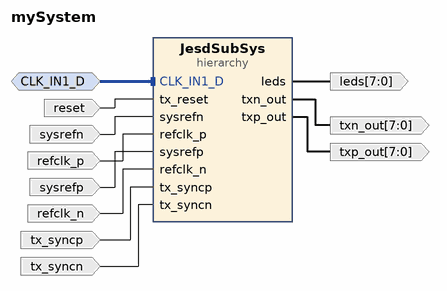
[diagram p0: block diagram of the top level]
# Vivado block design mySystem, xcku040-ffva1156-2-e, Vivado 2019.2
create_bd_design mySystem

create_bd_intf_port -mode Slave -vlnv xilinx.com:interface:diff_clock_rtl:1.0 CLK_IN1_D
set_property -dict {CONFIG.FREQ_HZ 300000000} [get_bd_intf_ports CLK_IN1_D]
create_bd_port -dir I -type rst reset
set_property -dict {CONFIG.POLARITY ACTIVE_HIGH} [get_bd_ports reset]
create_bd_port -dir O -from 7 -to 0 leds
create_bd_port -dir I sysrefn
create_bd_port -dir I refclk_p
create_bd_port -dir I sysrefp
create_bd_port -dir I refclk_n
create_bd_port -dir O -from 7 -to 0 txp_out
create_bd_port -dir O -from 7 -to 0 txn_out
create_bd_port -dir I tx_syncp
create_bd_port -dir I tx_syncn

create_bd_cell -type hier JesdSubSys

# ---- hierarchy /JesdSubSys ----
current_bd_instance /JesdSubSys
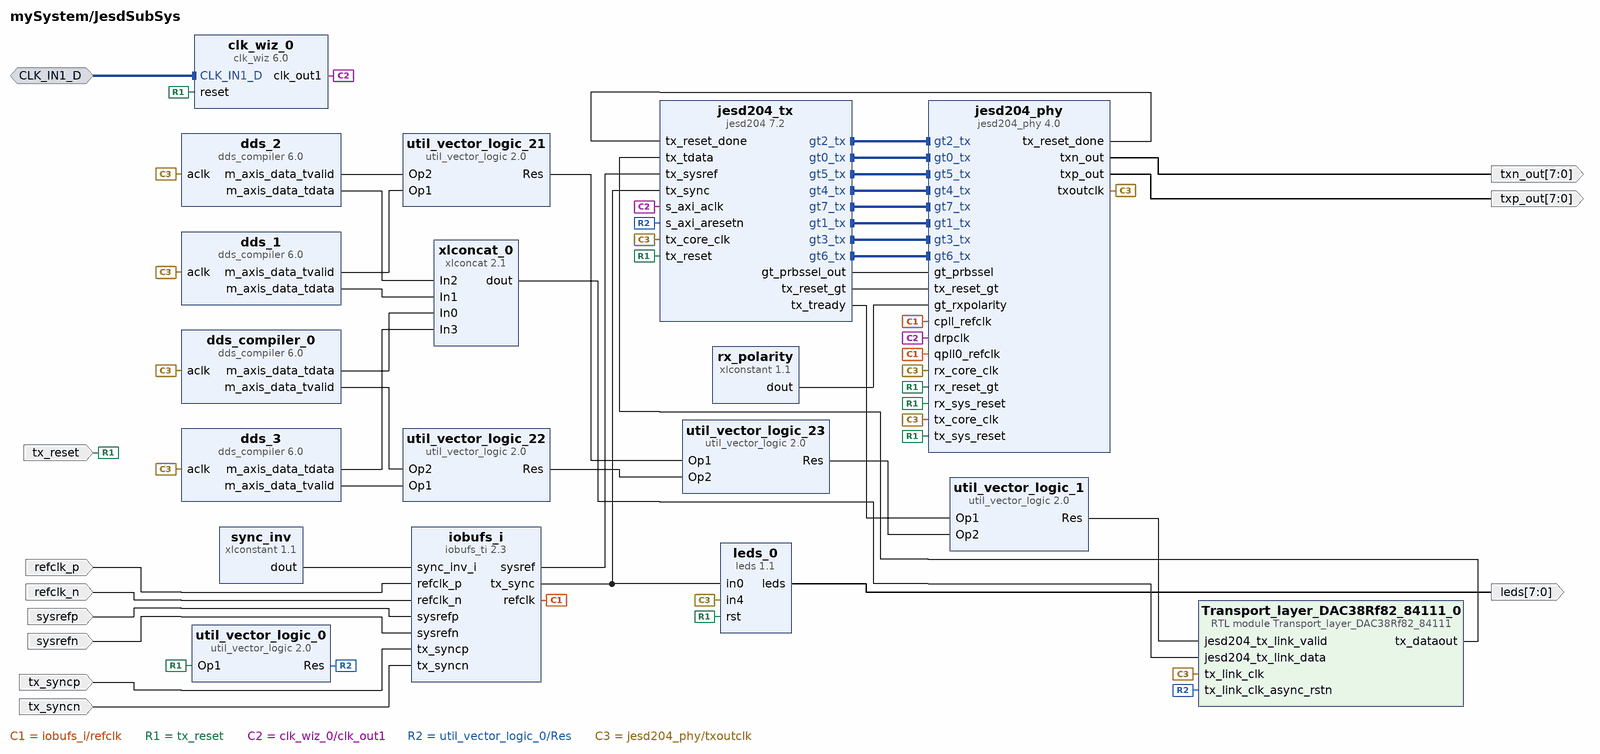
[diagram p1: block diagram inside /JesdSubSys]
create_bd_intf_pin -mode Slave -vlnv xilinx.com:interface:diff_clock_rtl:1.0 CLK_IN1_D
create_bd_pin -dir O -from 7 -to 0 leds
create_bd_pin -dir I refclk_n
create_bd_pin -dir I refclk_p
create_bd_pin -dir I sysrefn
create_bd_pin -dir I sysrefp
create_bd_pin -dir I tx_reset
create_bd_pin -dir O -from 7 -to 0 txp_out
create_bd_pin -dir O -from 7 -to 0 txn_out
create_bd_pin -dir I tx_syncp
create_bd_pin -dir I tx_syncn

create_bd_cell -type ip -vlnv user.org:user:leds:1.1 leds_0
set_property -dict {CONFIG.CNFG 120} [get_bd_cells leds_0]
create_bd_cell -type ip -vlnv user.org:user:iobufs_ti:2.3 iobufs_i
create_bd_cell -type module -reference Transport_layer_DAC38Rf82_84111 Transport_layer_DAC38Rf82_84111_0
create_bd_cell -type ip -vlnv xilinx.com:ip:util_vector_logic:2.0 util_vector_logic_0
set_property -dict {CONFIG.C_OPERATION not CONFIG.C_SIZE 1} [get_bd_cells util_vector_logic_0]
create_bd_cell -type ip -vlnv xilinx.com:ip:util_vector_logic:2.0 util_vector_logic_1
set_property -dict {CONFIG.C_OPERATION or CONFIG.C_SIZE 1} [get_bd_cells util_vector_logic_1]
create_bd_cell -type ip -vlnv xilinx.com:ip:util_vector_logic:2.0 util_vector_logic_21
set_property -dict {CONFIG.C_SIZE 1} [get_bd_cells util_vector_logic_21]
create_bd_cell -type ip -vlnv xilinx.com:ip:util_vector_logic:2.0 util_vector_logic_23
set_property -dict {CONFIG.C_SIZE 1} [get_bd_cells util_vector_logic_23]
create_bd_cell -type ip -vlnv xilinx.com:ip:util_vector_logic:2.0 util_vector_logic_22
set_property -dict {CONFIG.C_SIZE 1} [get_bd_cells util_vector_logic_22]
create_bd_cell -type ip -vlnv xilinx.com:ip:clk_wiz:6.0 clk_wiz_0
set_property -dict [list \
  CONFIG.CLKIN1_JITTER_PS 33.330000000000005 \
  CONFIG.CLKOUT1_DRIVES BUFGCE \
  CONFIG.CLKOUT1_JITTER 108.112 \
  CONFIG.CLKOUT1_PHASE_ERROR 105.563 \
  CONFIG.CLKOUT1_REQUESTED_OUT_FREQ 100 \
  CONFIG.CLKOUT2_DRIVES BUFGCE \
  CONFIG.CLKOUT2_JITTER 99.774 \
  CONFIG.CLKOUT2_PHASE_ERROR 105.563 \
  CONFIG.CLKOUT2_REQUESTED_OUT_FREQ 100.000 \
  CONFIG.CLKOUT2_USED false \
  CONFIG.CLKOUT3_DRIVES BUFGCE \
  CONFIG.CLKOUT4_DRIVES BUFGCE \
  CONFIG.CLKOUT5_DRIVES BUFGCE \
  CONFIG.CLKOUT6_DRIVES BUFGCE \
  CONFIG.CLKOUT7_DRIVES BUFGCE \
  CONFIG.CLK_IN1_BOARD_INTERFACE default_sysclk_300 \
  CONFIG.FEEDBACK_SOURCE FDBK_AUTO \
  CONFIG.MMCM_CLKFBOUT_MULT_F 2 \
  CONFIG.MMCM_CLKIN1_PERIOD 3.333 \
  CONFIG.MMCM_CLKIN2_PERIOD 10.0 \
  CONFIG.MMCM_CLKOUT0_DIVIDE_F 6 \
  CONFIG.MMCM_CLKOUT1_DIVIDE 1 \
  CONFIG.MMCM_COMPENSATION AUTO \
  CONFIG.MMCM_DIVCLK_DIVIDE 1 \
  CONFIG.NUM_OUT_CLKS 1 \
  CONFIG.PRIMITIVE PLL \
  CONFIG.PRIM_IN_FREQ 300.000 \
  CONFIG.PRIM_SOURCE Differential_clock_capable_pin \
  CONFIG.SECONDARY_SOURCE Single_ended_clock_capable_pin \
  CONFIG.USE_PHASE_ALIGNMENT false \
  CONFIG.USE_SAFE_CLOCK_STARTUP true \
] [get_bd_cells clk_wiz_0]
create_bd_cell -type ip -vlnv xilinx.com:ip:dds_compiler:6.0 dds_compiler_0
set_property -dict [list \
  CONFIG.DATA_Has_TLAST Not_Required \
  CONFIG.DDS_Clock_Rate 192 \
  CONFIG.Frequency_Resolution 0.4 \
  CONFIG.Has_Phase_Out true \
  CONFIG.Latency 8 \
  CONFIG.M_DATA_Has_TUSER Not_Required \
  CONFIG.Noise_Shaping None \
  CONFIG.Output_Frequency1 0 \
  CONFIG.Output_Selection Sine \
  CONFIG.Output_Width 16 \
  CONFIG.PINC1 1101010101100 \
  CONFIG.Parameter_Entry Hardware_Parameters \
  CONFIG.PartsPresent Phase_Generator_and_SIN_COS_LUT \
  CONFIG.Phase_Width 16 \
  CONFIG.Phase_offset Fixed \
  CONFIG.S_PHASE_Has_TUSER Not_Required \
] [get_bd_cells dds_compiler_0]
create_bd_cell -type ip -vlnv xilinx.com:ip:dds_compiler:6.0 dds_2
set_property -dict [list \
  CONFIG.DATA_Has_TLAST Not_Required \
  CONFIG.DDS_Clock_Rate 192 \
  CONFIG.Frequency_Resolution 0.4 \
  CONFIG.Has_Phase_Out true \
  CONFIG.Latency 8 \
  CONFIG.M_DATA_Has_TUSER Not_Required \
  CONFIG.Noise_Shaping None \
  CONFIG.Output_Frequency1 0 \
  CONFIG.Output_Selection Sine \
  CONFIG.Output_Width 16 \
  CONFIG.PINC1 1101010101100 \
  CONFIG.POFF1 110101010110 \
  CONFIG.Parameter_Entry Hardware_Parameters \
  CONFIG.PartsPresent Phase_Generator_and_SIN_COS_LUT \
  CONFIG.Phase_Width 16 \
  CONFIG.Phase_offset Fixed \
  CONFIG.S_PHASE_Has_TUSER Not_Required \
] [get_bd_cells dds_2]
create_bd_cell -type ip -vlnv xilinx.com:ip:dds_compiler:6.0 dds_1
set_property -dict [list \
  CONFIG.DATA_Has_TLAST Not_Required \
  CONFIG.DDS_Clock_Rate 192 \
  CONFIG.Frequency_Resolution 0.4 \
  CONFIG.Has_Phase_Out true \
  CONFIG.Latency 8 \
  CONFIG.M_DATA_Has_TUSER Not_Required \
  CONFIG.Noise_Shaping None \
  CONFIG.Output_Frequency1 0 \
  CONFIG.Output_Selection Sine \
  CONFIG.Output_Width 16 \
  CONFIG.PINC1 1101010101100 \
  CONFIG.POFF1 11010101011 \
  CONFIG.Parameter_Entry Hardware_Parameters \
  CONFIG.PartsPresent Phase_Generator_and_SIN_COS_LUT \
  CONFIG.Phase_Width 16 \
  CONFIG.Phase_offset Fixed \
  CONFIG.S_PHASE_Has_TUSER Not_Required \
] [get_bd_cells dds_1]
create_bd_cell -type ip -vlnv xilinx.com:ip:dds_compiler:6.0 dds_3
set_property -dict [list \
  CONFIG.DATA_Has_TLAST Not_Required \
  CONFIG.DDS_Clock_Rate 192 \
  CONFIG.Frequency_Resolution 0.4 \
  CONFIG.Has_Phase_Out true \
  CONFIG.Latency 8 \
  CONFIG.M_DATA_Has_TUSER Not_Required \
  CONFIG.Noise_Shaping None \
  CONFIG.Output_Frequency1 0 \
  CONFIG.Output_Selection Sine \
  CONFIG.Output_Width 16 \
  CONFIG.PINC1 1101010101100 \
  CONFIG.POFF1 1010000000001 \
  CONFIG.Parameter_Entry Hardware_Parameters \
  CONFIG.PartsPresent Phase_Generator_and_SIN_COS_LUT \
  CONFIG.Phase_Width 16 \
  CONFIG.Phase_offset Fixed \
  CONFIG.S_PHASE_Has_TUSER Not_Required \
] [get_bd_cells dds_3]
create_bd_cell -type ip -vlnv xilinx.com:ip:jesd204_phy:4.0 jesd204_phy
set_property -dict [list \
  CONFIG.Axi_Lite false \
  CONFIG.C_LANES 8 \
  CONFIG.C_PLL_SELECTION 1 \
  CONFIG.DRPCLK_FREQ 100 \
  CONFIG.GT_Line_Rate 7.68 \
  CONFIG.GT_REFCLK_FREQ 192 \
  CONFIG.RX_GT_Line_Rate 7.68 \
  CONFIG.RX_GT_REFCLK_FREQ 192 \
  CONFIG.RX_PLL_SELECTION 0 \
  CONFIG.TransceiverControl true \
] [get_bd_cells jesd204_phy]
create_bd_cell -type ip -vlnv xilinx.com:ip:jesd204:7.2 jesd204_tx
set_property -dict [list \
  CONFIG.AXICLK_FREQ 100.0 \
  CONFIG.C_DEFAULT_F 1 \
  CONFIG.C_DEFAULT_K 20 \
  CONFIG.C_DEFAULT_SCR 0 \
  CONFIG.C_LANES 8 \
  CONFIG.C_NODE_IS_TRANSMIT 1 \
] [get_bd_cells jesd204_tx]
create_bd_cell -type ip -vlnv xilinx.com:ip:xlconcat:2.1 xlconcat_0
set_property -dict [list \
  CONFIG.IN0_WIDTH 16 \
  CONFIG.IN1_WIDTH 16 \
  CONFIG.IN2_WIDTH 16 \
  CONFIG.IN3_WIDTH 16 \
  CONFIG.NUM_PORTS 4 \
  CONFIG.dout_width 64 \
] [get_bd_cells xlconcat_0]
create_bd_cell -type ip -vlnv xilinx.com:ip:xlconstant:1.1 rx_polarity
set_property -dict {CONFIG.CONST_VAL 0 CONFIG.CONST_WIDTH 8} [get_bd_cells rx_polarity]
create_bd_cell -type ip -vlnv xilinx.com:ip:xlconstant:1.1 sync_inv
set_property -dict {CONFIG.CONST_VAL 0 CONFIG.CONST_WIDTH 1} [get_bd_cells sync_inv]

# ---- connections ----

current_bd_instance /JesdSubSys
connect_bd_intf_net [get_bd_intf_pins jesd204_tx/gt2_tx] [get_bd_intf_pins jesd204_phy/gt2_tx]
connect_bd_intf_net [get_bd_intf_pins jesd204_tx/gt0_tx] [get_bd_intf_pins jesd204_phy/gt0_tx]
connect_bd_intf_net [get_bd_intf_pins jesd204_tx/gt5_tx] [get_bd_intf_pins jesd204_phy/gt5_tx]
connect_bd_intf_net [get_bd_intf_pins jesd204_tx/gt4_tx] [get_bd_intf_pins jesd204_phy/gt4_tx]
connect_bd_intf_net [get_bd_intf_pins jesd204_tx/gt7_tx] [get_bd_intf_pins jesd204_phy/gt7_tx]
connect_bd_intf_net [get_bd_intf_pins CLK_IN1_D] [get_bd_intf_pins clk_wiz_0/CLK_IN1_D]
connect_bd_intf_net [get_bd_intf_pins jesd204_tx/gt1_tx] [get_bd_intf_pins jesd204_phy/gt1_tx]
connect_bd_intf_net [get_bd_intf_pins jesd204_tx/gt3_tx] [get_bd_intf_pins jesd204_phy/gt3_tx]
connect_bd_intf_net [get_bd_intf_pins jesd204_tx/gt6_tx] [get_bd_intf_pins jesd204_phy/gt6_tx]
connect_bd_net -net jesd_data_if_0_refclk [get_bd_pins iobufs_i/refclk] [get_bd_pins jesd204_phy/cpll_refclk] [get_bd_pins jesd204_phy/qpll0_refclk]
connect_bd_net [get_bd_pins leds_0/leds] [get_bd_pins leds]
connect_bd_net [get_bd_pins refclk_p] [get_bd_pins iobufs_i/refclk_p]
connect_bd_net [get_bd_pins refclk_n] [get_bd_pins iobufs_i/refclk_n]
connect_bd_net [get_bd_pins sysrefp] [get_bd_pins iobufs_i/sysrefp]
connect_bd_net [get_bd_pins sysrefn] [get_bd_pins iobufs_i/sysrefn]
connect_bd_net -net tx_reset_1 [get_bd_pins tx_reset] \
  [get_bd_pins leds_0/rst] [get_bd_pins util_vector_logic_0/Op1] [get_bd_pins clk_wiz_0/reset] \
  [get_bd_pins jesd204_phy/rx_reset_gt] [get_bd_pins jesd204_phy/tx_sys_reset] [get_bd_pins jesd204_phy/rx_sys_reset] \
  [get_bd_pins jesd204_tx/tx_reset]
connect_bd_net -net xlconstant_0_dout [get_bd_pins rx_polarity/dout] [get_bd_pins jesd204_phy/gt_rxpolarity]
connect_bd_net [get_bd_pins clk_wiz_0/clk_out1] [get_bd_pins jesd204_phy/drpclk] [get_bd_pins jesd204_tx/s_axi_aclk]
connect_bd_net [get_bd_pins util_vector_logic_0/Res] \
  [get_bd_pins Transport_layer_DAC38Rf82_84111_0/tx_link_clk_async_rstn] [get_bd_pins jesd204_tx/s_axi_aresetn]
connect_bd_net -net xlconstant_1_dout [get_bd_pins sync_inv/dout] [get_bd_pins iobufs_i/sync_inv_i]
connect_bd_net -net jesd204_phy_rxoutclk1 [get_bd_pins jesd204_phy/txoutclk] \
  [get_bd_pins leds_0/in4] [get_bd_pins Transport_layer_DAC38Rf82_84111_0/tx_link_clk] [get_bd_pins dds_compiler_0/aclk] \
  [get_bd_pins dds_2/aclk] [get_bd_pins dds_1/aclk] [get_bd_pins dds_3/aclk] [get_bd_pins jesd204_phy/tx_core_clk] \
  [get_bd_pins jesd204_phy/rx_core_clk] [get_bd_pins jesd204_tx/tx_core_clk]
connect_bd_net [get_bd_pins dds_compiler_0/m_axis_data_tvalid] [get_bd_pins util_vector_logic_22/Op2]
connect_bd_net -net Sample_2 [get_bd_pins dds_2/m_axis_data_tdata] [get_bd_pins xlconcat_0/In2]
connect_bd_net -net Concat_OP [get_bd_pins xlconcat_0/dout] [get_bd_pins Transport_layer_DAC38Rf82_84111_0/jesd204_tx_link_data]
connect_bd_net [get_bd_pins jesd204_tx/gt_prbssel_out] [get_bd_pins jesd204_phy/gt_prbssel]
connect_bd_net [get_bd_pins jesd204_tx/tx_reset_gt] [get_bd_pins jesd204_phy/tx_reset_gt]
connect_bd_net [get_bd_pins jesd204_phy/tx_reset_done] [get_bd_pins jesd204_tx/tx_reset_done]
connect_bd_net [get_bd_pins iobufs_i/sysref] [get_bd_pins jesd204_tx/tx_sysref]
connect_bd_net -net Sample_0 [get_bd_pins dds_compiler_0/m_axis_data_tdata] [get_bd_pins xlconcat_0/In0]
connect_bd_net -net iobufs_i_tx_sync [get_bd_pins iobufs_i/tx_sync] [get_bd_pins leds_0/in0] [get_bd_pins jesd204_tx/tx_sync]
connect_bd_net [get_bd_pins jesd204_phy/txp_out] [get_bd_pins txp_out]
connect_bd_net [get_bd_pins jesd204_phy/txn_out] [get_bd_pins txn_out]
connect_bd_net -net Transport_layer_DAC38Rf82_84111_0_rx_dataout [get_bd_pins Transport_layer_DAC38Rf82_84111_0/tx_dataout] \
  [get_bd_pins jesd204_tx/tx_tdata]
connect_bd_net [get_bd_pins tx_syncp] [get_bd_pins iobufs_i/tx_syncp]
connect_bd_net [get_bd_pins tx_syncn] [get_bd_pins iobufs_i/tx_syncn]
connect_bd_net [get_bd_pins dds_3/m_axis_data_tvalid] [get_bd_pins util_vector_logic_22/Op1]
connect_bd_net [get_bd_pins dds_2/m_axis_data_tvalid] [get_bd_pins util_vector_logic_21/Op2]
connect_bd_net [get_bd_pins dds_1/m_axis_data_tvalid] [get_bd_pins util_vector_logic_21/Op1]
connect_bd_net [get_bd_pins util_vector_logic_22/Res] [get_bd_pins util_vector_logic_23/Op2]
connect_bd_net [get_bd_pins util_vector_logic_21/Res] [get_bd_pins util_vector_logic_23/Op1]
connect_bd_net [get_bd_pins util_vector_logic_23/Res] [get_bd_pins util_vector_logic_1/Op2]
connect_bd_net -net Sample_3 [get_bd_pins dds_3/m_axis_data_tdata] [get_bd_pins xlconcat_0/In3]
connect_bd_net -net Sample_1 [get_bd_pins dds_1/m_axis_data_tdata] [get_bd_pins xlconcat_0/In1]
connect_bd_net -net jesd204_tx_tx_tready [get_bd_pins jesd204_tx/tx_tready] [get_bd_pins util_vector_logic_1/Op1]
connect_bd_net [get_bd_pins util_vector_logic_1/Res] [get_bd_pins Transport_layer_DAC38Rf82_84111_0/jesd204_tx_link_valid]
set_property HDL_ATTRIBUTE.MARK_DEBUG true [get_bd_nets tx_reset_1]
set_property HDL_ATTRIBUTE.MARK_DEBUG true [get_bd_nets Sample_2]
set_property HDL_ATTRIBUTE.MARK_DEBUG true [get_bd_nets Concat_OP]
set_property HDL_ATTRIBUTE.MARK_DEBUG true [get_bd_nets Sample_0]
set_property HDL_ATTRIBUTE.MARK_DEBUG true [get_bd_nets iobufs_i_tx_sync]
set_property HDL_ATTRIBUTE.MARK_DEBUG true [get_bd_nets Transport_layer_DAC38Rf82_84111_0_rx_dataout]
set_property HDL_ATTRIBUTE.MARK_DEBUG true [get_bd_nets Sample_3]
set_property HDL_ATTRIBUTE.MARK_DEBUG true [get_bd_nets Sample_1]
set_property HDL_ATTRIBUTE.MARK_DEBUG true [get_bd_nets jesd204_tx_tx_tready]

current_bd_instance /
connect_bd_intf_net [get_bd_intf_ports CLK_IN1_D] [get_bd_intf_pins JesdSubSys/CLK_IN1_D]
connect_bd_net [get_bd_ports reset] [get_bd_pins JesdSubSys/tx_reset]
connect_bd_net [get_bd_pins JesdSubSys/leds] [get_bd_ports leds]
connect_bd_net [get_bd_ports sysrefn] [get_bd_pins JesdSubSys/sysrefn]
connect_bd_net [get_bd_ports refclk_p] [get_bd_pins JesdSubSys/refclk_p]
connect_bd_net [get_bd_ports sysrefp] [get_bd_pins JesdSubSys/sysrefp]
connect_bd_net [get_bd_ports refclk_n] [get_bd_pins JesdSubSys/refclk_n]
connect_bd_net [get_bd_pins JesdSubSys/txp_out] [get_bd_ports txp_out]
connect_bd_net [get_bd_pins JesdSubSys/txn_out] [get_bd_ports txn_out]
connect_bd_net [get_bd_ports tx_syncp] [get_bd_pins JesdSubSys/tx_syncp]
connect_bd_net [get_bd_ports tx_syncn] [get_bd_pins JesdSubSys/tx_syncn]

validate_bd_design
save_bd_design
